# EAGLE design indicator_assembly (EAGLE 9.0.1)
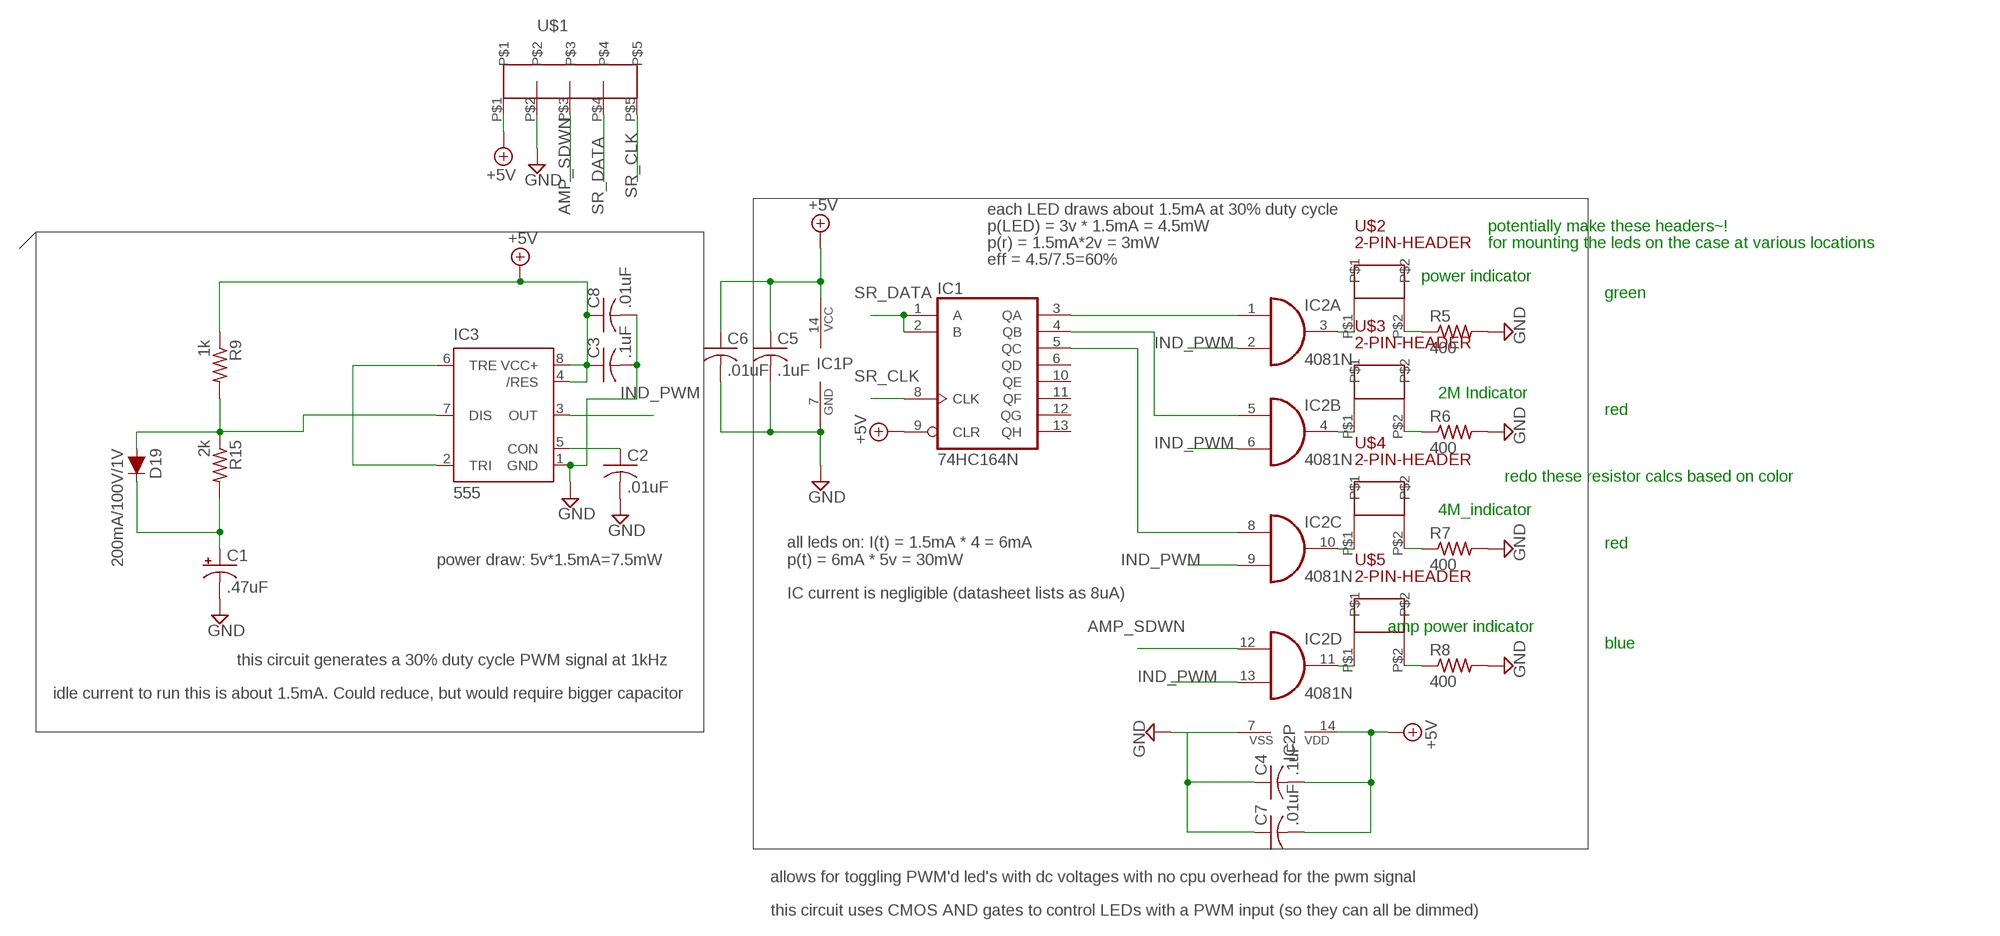
[diagram p0: schematic, sheet 1]

## Parts
C1  .47uF  CPOL-USE2-4  [E2-4]
C2  .01uF  C-US025-030X050  [C025-030X050]
C3  .1uF  C-US025-030X050  [C025-030X050]
C4  .1uF  C-US025-030X050  [C025-030X050]
C5  .1uF  C-US025-030X050  [C025-030X050]
C6  .01uF  C-US025-030X050  [C025-030X050]
C7  .01uF  C-US025-030X050  [C025-030X050]
C8  .01uF  C-US025-030X050  [C025-030X050]
D19  200mA/100V/1V  DIODE-1N4148  [DIODE-1N4148]
IC1  74HC164N  [DIL14]
IC2  4081N  [DIL14]
IC3  555  555P  [DIP08]
R5  400  R-US_0204/7  [0204/7]
R6  400  R-US_0204/7  [0204/7]
R7  400  R-US_0204/7  [0204/7]
R8  400  R-US_0204/7  [0204/7]
R9  1k  R-US_0204/7  [0204/7]
R15  2k  R-US_0204/7  [0204/7]
U$1  5-PIN-HEADER  [5-PIN-HEADER]
U$2  2-PIN-HEADER  [2-PIN-HEADER]
U$3  2-PIN-HEADER  [2-PIN-HEADER]
U$4  2-PIN-HEADER  [2-PIN-HEADER]
U$5  2-PIN-HEADER  [2-PIN-HEADER]

## Nets
+5V: C3.1 C4.2 C5.1 C6.1 C7.2 C8.1 IC1.9(CLR) IC1.14(VCC) IC2.14(P:VDD) IC3.4(/RES) IC3.8(VCC+) R9.1 U$1.P$1
AMP_SDWN: IC2.12(D:I0) U$1.P$3
GND: C1.- C2.2 C3.2 C4.1 C5.2 C6.2 C7.1 C8.2 IC1.7(GND) IC2.7(P:VSS) IC3.1(GND) R5.2 R6.2 R7.2 R8.2 U$1.P$2
IND_PWM: IC2.2(A:I1) IC2.6(B:I1) IC2.9(C:I1) IC2.13(D:I1) IC3.3(OUT)
N$14: IC1.3(QA) IC2.1(A:I0)
N$17: IC1.4(QB) IC2.5(B:I0)
N$47: IC2.3(A:O) U$2.P$1
N$49: IC1.5(QC) IC2.8(C:I0)
N$50: R5.1 U$2.P$2
N$51: IC2.4(B:O) U$3.P$1
N$54: R6.1 U$3.P$2
N$55: IC2.10(C:O) U$4.P$1
N$56: R7.1 U$4.P$2
N$57: IC2.11(D:O) U$5.P$1
N$58: R8.1 U$5.P$2
N$59: IC3.2(TRI) IC3.6(TRE)
N$60: D19.A IC3.7(DIS) R9.2 R15.1
N$61: C2.1 IC3.5(CON)
N$62: C1.+ D19.C R15.2
SR_CLK: IC1.8(CLK) U$1.P$5
SR_DATA: IC1.1(A) IC1.2(B) U$1.P$4
Unconnected: IC1.6(QD) IC1.10(QE) IC1.11(QF) IC1.12(QG) IC1.13(QH)

## Notes on the sheet
- each LED draws about 1.5mA at 30% duty cycle
- p(LED) = 3v * 1.5mA = 4.5mW | potentially make these headers~!
- p(r) = 1.5mA*2v = 3mW | for mounting the leds on the case at various locations
- eff = 4.5/7.5=60%
- power indicator
- green
- 2M Indicator
- red
- redo these resistor calcs based on color
- 4M_indicator
- red
- power draw: 5v*1.5mA=7.5mW
- all leds on: I(t) = 1.5mA * 4 = 6mA
  p(t) = 6mA * 5v = 30mW
- IC current is negligible (datasheet lists as 8uA)
- amp power indicator
- blue
- this circuit generates a 30% duty cycle PWM signal at 1kHz
- idle current to run this is about 1.5mA. Could reduce, but would require bigger capacitor
- allows for toggling PWM'd led's with dc voltages with no cpu overhead for the pwm signal
- this circuit uses CMOS AND gates to control LEDs with a PWM input (so they can all be dimmed)

## Library data of the parts
C1 = rcl:CPOL-US: POLARIZED CAPACITOR, American symbol; SPICEPREFIX: C
C2-C8 = rcl:C-US: CAPACITOR, American symbol; SPICEPREFIX: C
D19 = SparkFun-DiscreteSemi:DIODE: Diode These are standard reverse protection diodes and small signal diodes. SparkFun Products: SparkFun SparkPunk Sound Kit <https://www.sparkfun.com/products/11177> SparkFun ESP8266 Thing <https://www.sparkfun.com/products/13231>; PROD_ID: DIO-08378
IC1 = 74xx-us:74*164: 8-bit parallel out SHIFT REGISTER
IC2 = 40xx:4081: Quad 2-input AND
IC3 = SparkFun-IC-Special-Function:555: General purpose bipolar Timer Datasheet <http://www.sparkfun.com/datasheets/Components/General/ne555.pdf> SparkFun Products SparkFun SparkPunk Sequencer Kit <https://www.sparkfun.com/products/12707> (KIT-12707) Storefront Component: 555 Timer <https://www.sparkfun.com/products/9273> (COM-09273) Two parts valid for production: VFP: IC-11930 (M7555 PTH) VFP: IC-09173 (555 PTH) - Preferred; PROD_ID: IC-09173; PROD_ID_ALT: IC-09173
R5-R9 R15 = rcl:R-US_: RESISTOR, American symbol; SPICEPREFIX: R
U$1 = mask_lbr:5-PIN-HEADER
U$2-U$5 = mask_lbr:2-PIN-HEADER

## Net classes
0 default: width 0.508 mm, drill 0.254 mm, clearance 0.305 mm
1 power: width 0.762 mm, drill 0.254 mm, clearance 0.381 mm

## Board
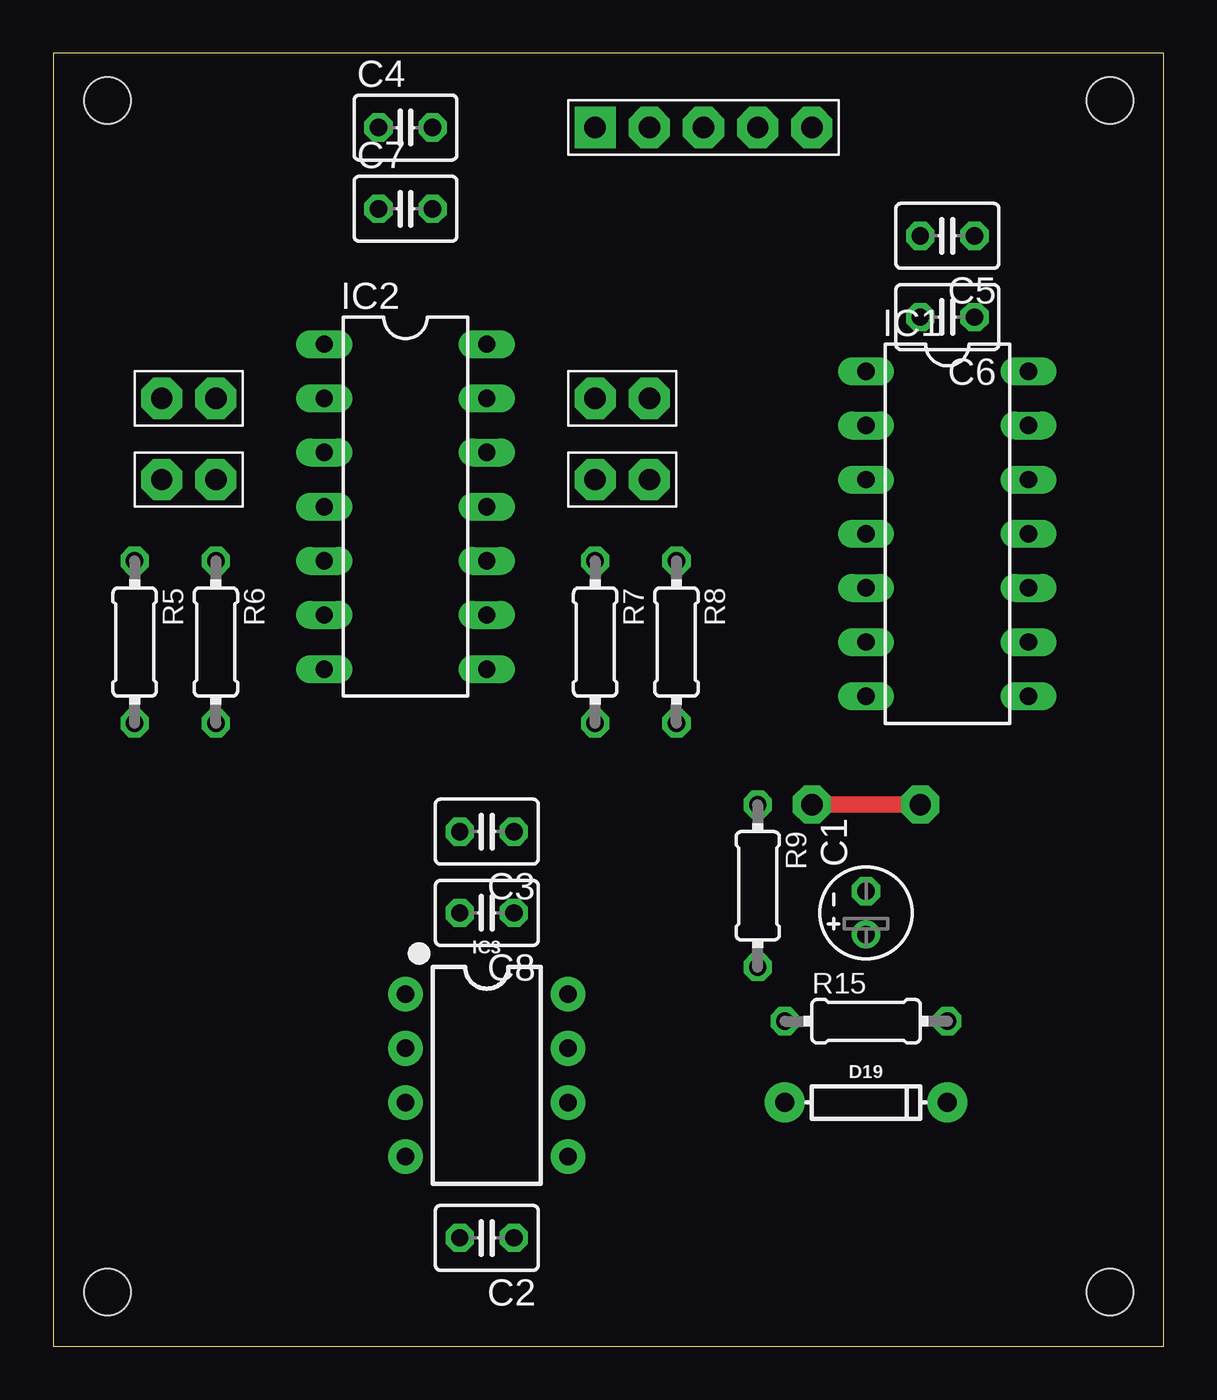
[diagram p1: board, top side]
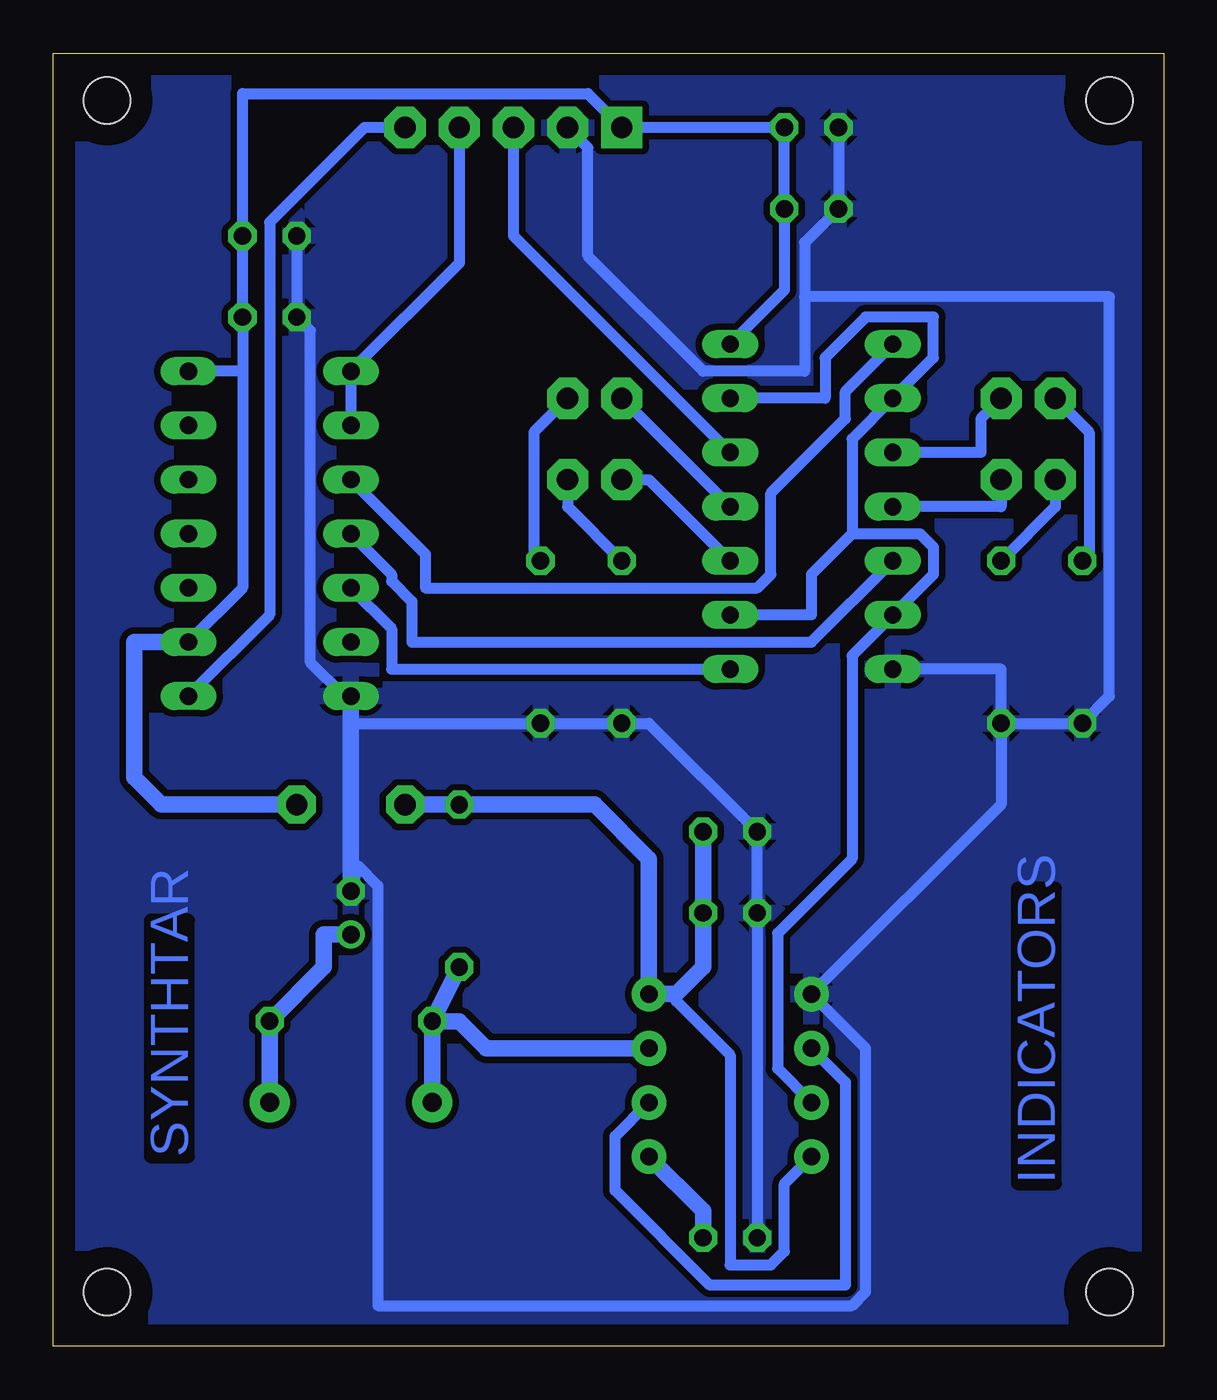
[diagram p2: board, bottom side, seen from below]

Size 52.05 x 60.63 mm. Coordinates in mm from the lower left corner, seen from the top.
Outline: 0,0 52.05,0 52.05,60.63 0,60.63 0,0
Copper layers (1*16): Top 0.035mm / dielectric 1.5mm / Bottom 0.035mm
Design rules "default": minimum track width 6mil, minimum drill 0.35mm, track to track 6mil, track to pad 6mil, pad to pad 6mil, via to via 6mil, smd to smd 6mil, copper to edge 40mil, drill to drill 6mil, minimum pad ring 10mil, minimum via ring 8mil, stop-mask expansion 4mil, vias tented up to drill 0mil, thermal gap 10mil
Holes 2.18 mm at 2.54,2.54 49.53,2.54 49.53,58.42 2.54,58.42

### Footprints (pad centres in the part's own frame; a part is rotated, then mirrored left to right if it is on the bottom)
E2-4 = drill 0.813 pad 1.27: + -1.016,0 | drill 0.813 pad 1.27 octagon: - 1.016,0
C025-030X050 = drill 0.813 octagon: 1 -1.27,0; 2 1.27,0
DIODE-1N4148 = drill 0.9 pad 1.88: A -3.81,0; C 3.81,0
DIL14 = drill 0.813 long: 1 -7.62,-3.81; 2 -5.08,-3.81; 3 -2.54,-3.81; 4 0,-3.81; 5 2.54,-3.81; 6 5.08,-3.81; 7 7.62,-3.81; 8 7.62,3.81; 9 5.08,3.81; 10 2.54,3.81; 11 0,3.81; 12 -2.54,3.81; 13 -5.08,3.81; 14 -7.62,3.81
DIP08 = drill 0.813 pad 1.626: 1 -3.81,-3.81; 2 -1.27,-3.81; 3 1.27,-3.81; 4 3.81,-3.81; 5 3.81,3.81; 6 1.27,3.81; 7 -1.27,3.81; 8 -3.81,3.81
0204/7 = drill 0.813 octagon: 1 -3.81,0; 2 3.81,0
5-PIN-HEADER = drill 1 pad 1.93 square: P$1 -5.08,0 | drill 1 pad 1.93 octagon: P$2 -2.54,0; P$3 0,0; P$4 2.54,0; P$5 5.08,0
2-PIN-HEADER = drill 1 pad 1.93 octagon: P$1 -1.27,0; P$2 1.27,0

### Placement (x,y rotation side)
C1  38.1,20.32 90 top
C2  20.32,5.08 180 top
C3  20.32,24.13 180 top
C4  16.51,57.15 0 top
C5  41.91,52.07 180 top
C6  41.91,48.26 180 top
C7  16.51,53.34 0 top
C8  20.32,20.32 180 top
D19  38.1,11.43 0 top
IC1  41.91,38.1 270 top
IC2  16.51,39.37 270 top
IC3  20.32,12.7 270 top
R5  3.81,33.02 270 top
R6  7.62,33.02 270 top
R7  25.4,33.02 270 top
R8  29.21,33.02 270 top
R9  33.02,21.59 270 top
R15  38.1,15.24 0 top
U$1  30.48,57.15 0 top
U$2  6.35,44.45 180 top
U$3  6.35,40.64 180 top
U$4  26.67,40.64 0 top
U$5  26.67,44.45 0 top

### Tracks (layer width: path | path; a pad name or v marks a point on that pad's centre or on a via)
+5V  (via drill 1 pad 1.78)
  Top 0.762: v35.56,25.4 v40.64,25.4
  Bottom 0.508: IC2.14 17.78,49.53 C7.2 C4.2 U$1.P$1 26.99,58.74 43.18,58.74 C5.1 C6.1 43.18,45.72 | IC1.9 43.18,35.56 43.18,45.72 | 43.18,45.72 IC1.14 | IC3.4 17.78,7.62 17.78,4.45 18.42,3.81 20.32,3.81 20.32,13.65 22.86,16.19 22.86,16.51
  Bottom 0.762: C3.1 C8.1 21.59,17.78 22.86,16.51 IC3.8 24.13,22.86 26.67,25.4 R9.1 v35.56,25.4 | IC1.9 48.26,33.02 48.26,26.67 46.99,25.4 v40.64,25.4
AMP_SDWN
  Bottom 0.508: IC2.12 30.48,52.07 U$1.P$3
GND
  Bottom 0.508: C4.1 C7.1 16.83,51.75 16.83,49.21 | U$1.P$2 26.99,56.2 26.99,51.12 21.59,45.72 16.83,45.72 16.83,49.21 | R6.2 R5.2 2.54,30.48 2.54,49.21 16.83,49.21 | IC2.7 7.62,31.75 R6.2 | R6.2 7.62,25.4 IC3.1 13.97,13.97 13.97,2.54 14.6,1.91 36.83,1.91 36.83,21.59 37.78,22.54 C1.- | C2.2 C8.2 C3.2 24.13,29.21 R7.2 R8.2 38.1,29.21 | C5.2 C6.2 40,47.62 40,32.07 38.42,30.48 IC1.7
  Bottom 0.762: C1.- 38.1,29.21 IC1.7
  pour Bottom: 0,60.96 52.07,60.96 52.07,0 0,0
IND_PWM
  Bottom 0.508: 14.6,38.1 11.43,38.1 10.79,37.46 10.79,36.2 IC2.6 14.6,32.38 14.6,22.86 18.1,19.37 18.1,13.02 IC3.3 | 14.6,38.1 14.6,42.55 IC2.2 10.79,46.35 10.79,48.26 13.97,48.26 15.87,46.35 15.87,44.45 IC2.13 | IC2.9 16.51,34.29 16.51,36.2 14.6,38.1
N$14
  Bottom 0.508: IC2.1 14.92,44.77 14.92,43.5 18.42,40 18.42,36.2 19.05,35.56 34.61,35.56 34.61,37.15 IC1.3
N$17
  Bottom 0.508: IC2.5 16.51,33.02 35.24,33.02 35.24,34.92 36.2,35.88 36.2,36.2 IC1.4
N$47
  Bottom 0.508: IC2.3 8.57,41.91 8.57,43.5 U$2.P$1
N$49
  Bottom 0.508: IC2.8 36.2,31.75 36.2,33.66 IC1.5
N$50
  Bottom 0.508: R5.1 3.49,37.15 3.49,42.86 U$2.P$2
N$51
  Bottom 0.508: IC2.4 7.62,39.37 U$3.P$1
N$54
  Bottom 0.508: R6.1 5.08,39.37 U$3.P$2
N$55
  Bottom 0.508: IC2.10 24.13,40.64 U$4.P$1
N$56
  Bottom 0.508: R7.1 27.94,39.37 U$4.P$2
N$57
  Bottom 0.508: U$5.P$1 IC2.11
N$58
  Bottom 0.508: R8.1 29.53,37.15 29.53,42.86 U$5.P$2
N$59
  Bottom 0.508: IC3.6 25.72,9.84 25.72,7.3 21.27,2.86 14.92,2.86 14.92,12.38 IC3.2
N$60
  Bottom 0.762: R15.1 33.02,15.24 31.75,13.97 IC3.7 | D19.A R15.1 | R9.2 R15.1
N$61
  Bottom 0.762: C2.1 21.59,6.35 IC3.5
N$62
  Bottom 0.762: D19.C R15.2 39.37,17.78 39.37,19.3 C1.+
SR_CLK
  Bottom 0.508: IC1.8 41.91,34.29 41.91,52.7 37.46,57.15 U$1.P$5
SR_DATA
  Bottom 0.508: IC1.2 IC1.1 33.02,50.8 U$1.P$4

### Text on the board
Bottom: SYNTHTAR | INDICATORS